# Altium schematic sheet SMD 4P FH.schdoc
size 124 x 99 mm
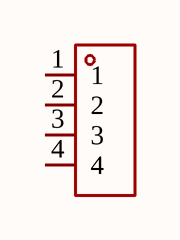
[diagram p0: SMD 4P FH.schdoc]

## Parts
CN?  F136-1104S3CMUB2  [HDR-SMD_4P-P2.54-V-M-LS5.0]  (value not drawn)

## Nets

Not connected (* = marked no-connect by the designer): CN? 1 2 3 4

## Library data of the parts
CN? = F136-1104S3CMUB2: Manufacturer: Yxcon(宇熙精密); Add into BOM: yes; Holes Structure: 1x4P; Pitch: 2.54mm; Number of Holes: 4P; Symbol: F136-1104S3CMUB2; Device: F136-1104S3CMUB2; LCSC Part Name: 1x4P 间距:2.54mm; Supplier Part: C20071191; Manufacturer Part: F136-1104S3CMUB2; Supplier Footprint: SMD,P=2.54mm(交错脚); JLCPCB Part Class: Extended Part; Datasheet: https://atta.szlcsc.com/upload/public/pdf/source/20231229/6268F0CB0A5C868446EF560AB6378120.pdf; Supplier: LCSC; Convert to PCB: yes; Number of Rows: Plugin; Insulation Height: 3.5mm; Contact Material: bronze; Contact Plating: Tin; Operating Temperature Range: -40℃~+105℃